# Altium schematic sheet ECG_AFE_ADS1292 test.SchDoc
size 420 x 297 mm; SheetNumber: 7; SheetTotal: 7
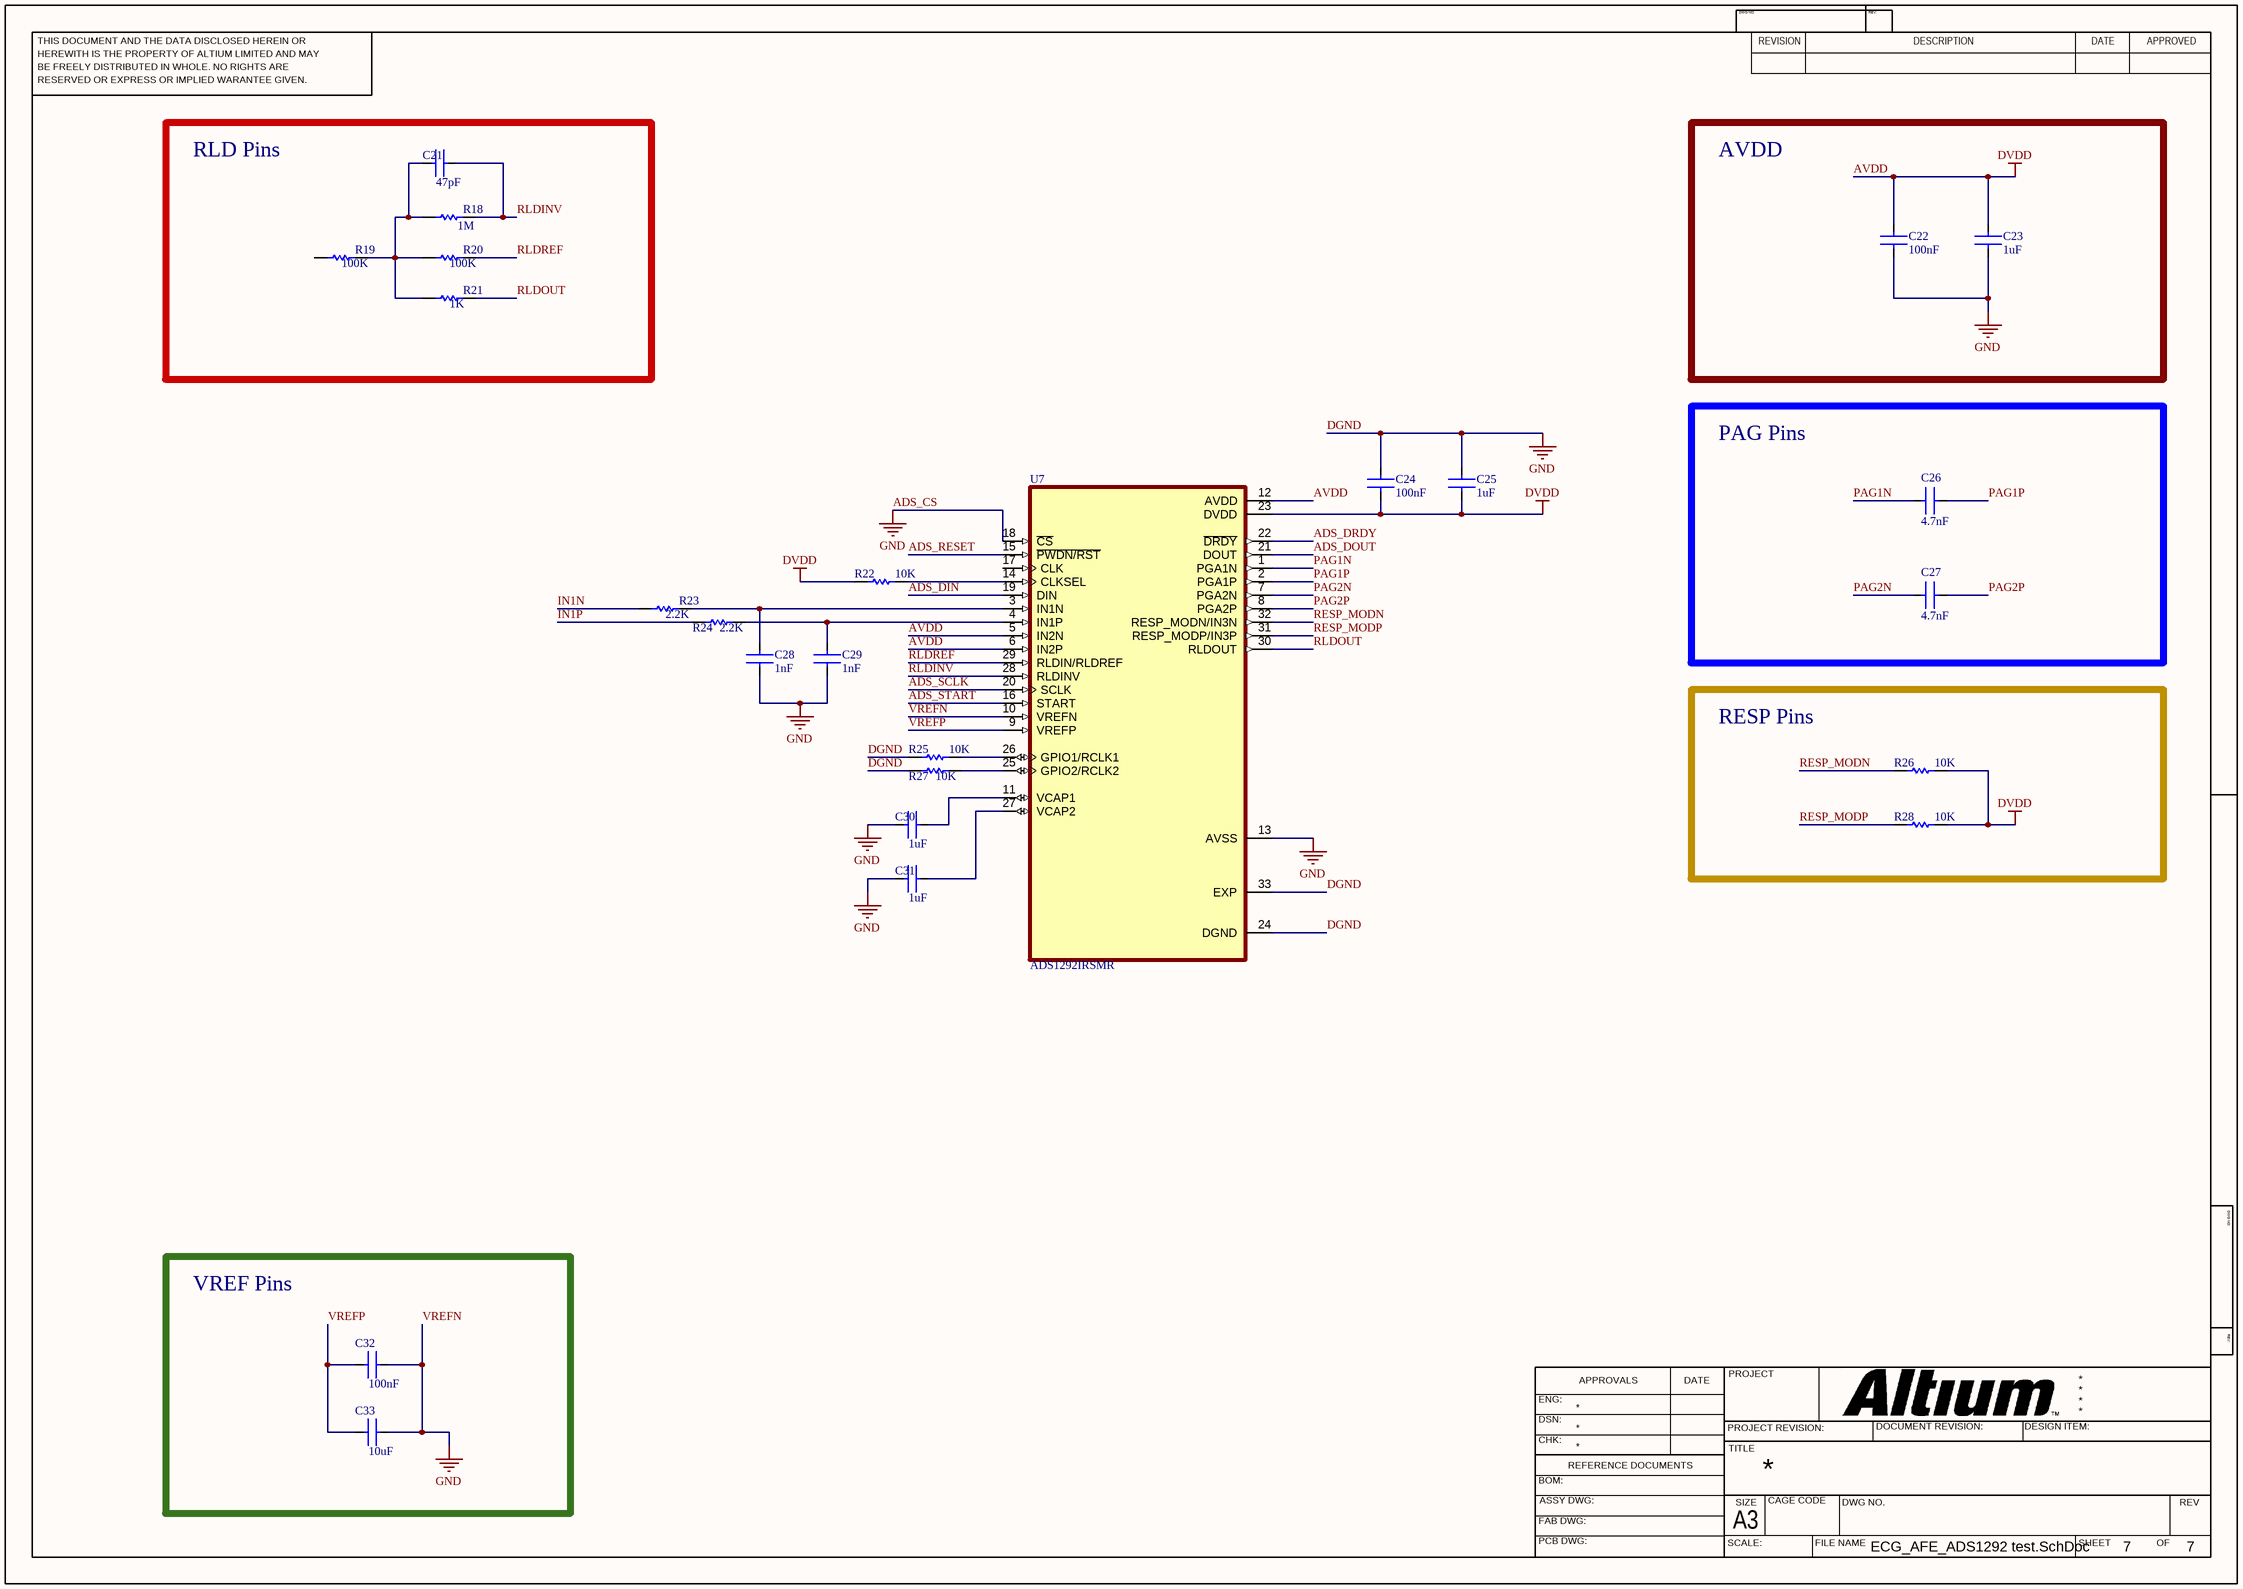
[diagram p0: ECG_AFE_ADS1292 test.SchDoc]

## Parts
C21  47pF  [C_0805]
C22  100nF  [C_0805]
C23  1uF  [C_0805]
C24  100nF  [C_0805]
C25  1uF  [C_0805]
C26  4.7nF  [C_0805]
C27  4.7nF  [C_0805]
C28  1nF  [C_0805]
C29  1nF  [C_0805]
C30  1uF  [C_0805]
C31  1uF  [C_0805]
C32  100nF  [C_0805]
C33  10uF  [C_0805]
R18  1M  [RESC2013X60X35ML10T20]
R19  100K  [RESC2013X60X35ML10T20]
R20  100K  [RESC2013X60X35ML10T20]
R21  1K  [RESC2013X60X35ML10T20]
R22  10K  [RESC2013X60X35ML10T20]
R23  2.2K  [RESC2013X60X35ML10T20]
R24  2.2K  [RESC2013X60X35ML10T20]
R25  10K  [RESC2013X60X35ML10T20]
R26  10K  [RESC2013X60X35ML10T20]
R27  10K  [RESC2013X60X35ML10T20]
R28  10K  [RESC2013X60X35ML10T20]
U7  ADS1292IRSMR  [QFN40P400X400X100-33N]

## Blocks framed on the sheet
RLD Pins: C21 R18-R21
AVDD: C22 C23
PAG Pins: C26 C27
RESP Pins: R26 R28
VREF Pins: C32 C33

## Nets
ADS_CS: C22.1 C23.1 C24.2 C25.2 C28.1 C29.1 C30.1 C31.1 C32.2 C33.2 R25.1 R27.1 U7.10(VREFN) U7.13(AVSS) U7.18(~{CS}) U7.24(DGND) U7.33(EXP)  [also labelled DGND, GND, VREFN]
AVDD: C22.2 C23.2 C24.1 C25.1 R22.1 R26.2 R28.2 U7.5(IN2N) U7.6(IN2P) U7.12(AVDD) U7.23(DVDD)  [also labelled DVDD]
ADS_DIN: U7.19(DIN)
ADS_DOUT: U7.21(DOUT)
ADS_DRDY: U7.22(~{DRDY})
ADS_RESET: U7.15(~{PWDN/RST})
ADS_SCLK: U7.20(SCLK)
ADS_START: U7.16(START)
IN1N: R23.1
IN1P: R24.1
PAG1N: C26.2 U7.1(PGA1N)
PAG1P: C26.1 U7.2(PGA1P)
PAG2N: C27.2 U7.7(PGA2N)
PAG2P: C27.1 U7.8(PGA2P)
RESP_MODN: R26.1 U7.32(RESP_MODN/IN3N)
RESP_MODP: R28.1 U7.31(RESP_MODP/IN3P)
RLDINV: C21.2 R18.2 U7.28(RLDINV)
RLDOUT: R21.2 U7.30(RLDOUT)
RLDREF: R20.2 U7.29(RLDIN/RLDREF)
VREFP: C32.1 C33.1 U7.9(VREFP)
NetC21_1: C21.1 R18.1 R19.2 R20.1 R21.1
NetC28_2: C28.2 R23.2 U7.3(IN1N)
NetC29_2: C29.2 R24.2 U7.4(IN1P)
NetC30_2: C30.2 U7.11(VCAP1)
NetC31_2: C31.2 U7.27(VCAP2)
NetR22_2: R22.2 U7.14(CLKSEL)
NetR25_2: R25.2 U7.26(GPIO1/RCLK1)
NetR27_2: R27.2 U7.25(GPIO2/RCLK2)

Not connected (* = marked no-connect by the designer): R19 1; U7 17(CLK)

## Notes on the sheet
- THIS DOCUMENT AND THE DATA DISCLOSED HEREIN OR
- HEREWITH IS THE PROPERTY OF ALTIUM LIMITED AND MAY
- DWG NO:
- REVISION
- REV:
- DESCRIPTION
- DATE
- APPROVED
- BE FREELY DISTRIBUTED IN WHOLE. NO RIGHTS ARE
- RESERVED OR EXPRESS OR IMPLIED WARANTEE GIVEN.
- ENG:
- APPROVALS
- PROJECT
- DSN:
- CHK:
- REFERENCE DOCUMENTS
- PROJECT REVISION:
- TITLE
- DOCUMENT REVISION:
- DESIGN ITEM:
- BOM:
- FAB DWG:
- PCB DWG:
- ASSY DWG:
- SCALE:
- A3
- SIZE
- CAGE CODE
- FILE NAME
- DWG NO.
- SHEET
- OF
- REV

## Library data of the parts
C21-C33 = CAP-0805-16V-SMD-IPC_A
R18-R28 = 10k 0805
U7 = ADS1292IRSMR: 24-bit, 2-ch, Low-Power Analog Front END (AFE) for ECG Applications; MF: Texas Instruments; SnapEDA_Link: https://www.snapeda.com/parts/ADS1292IRSMR/Texas+Instruments/view-part/?ref=snap; Package: VQFN-32 Texas Instruments; Value: *; MP: ADS1292IRSMR; Check_prices: https://www.snapeda.com/parts/ADS1292IRSMR/Texas+Instruments/view-part/?ref=eda